# Altium project ((Inventory)).PrjPcb (part 2 of 4)

## Sheet Resistor - 261-312.SchDoc
size A0; SheetNumber: 7; SheetTotal: 14
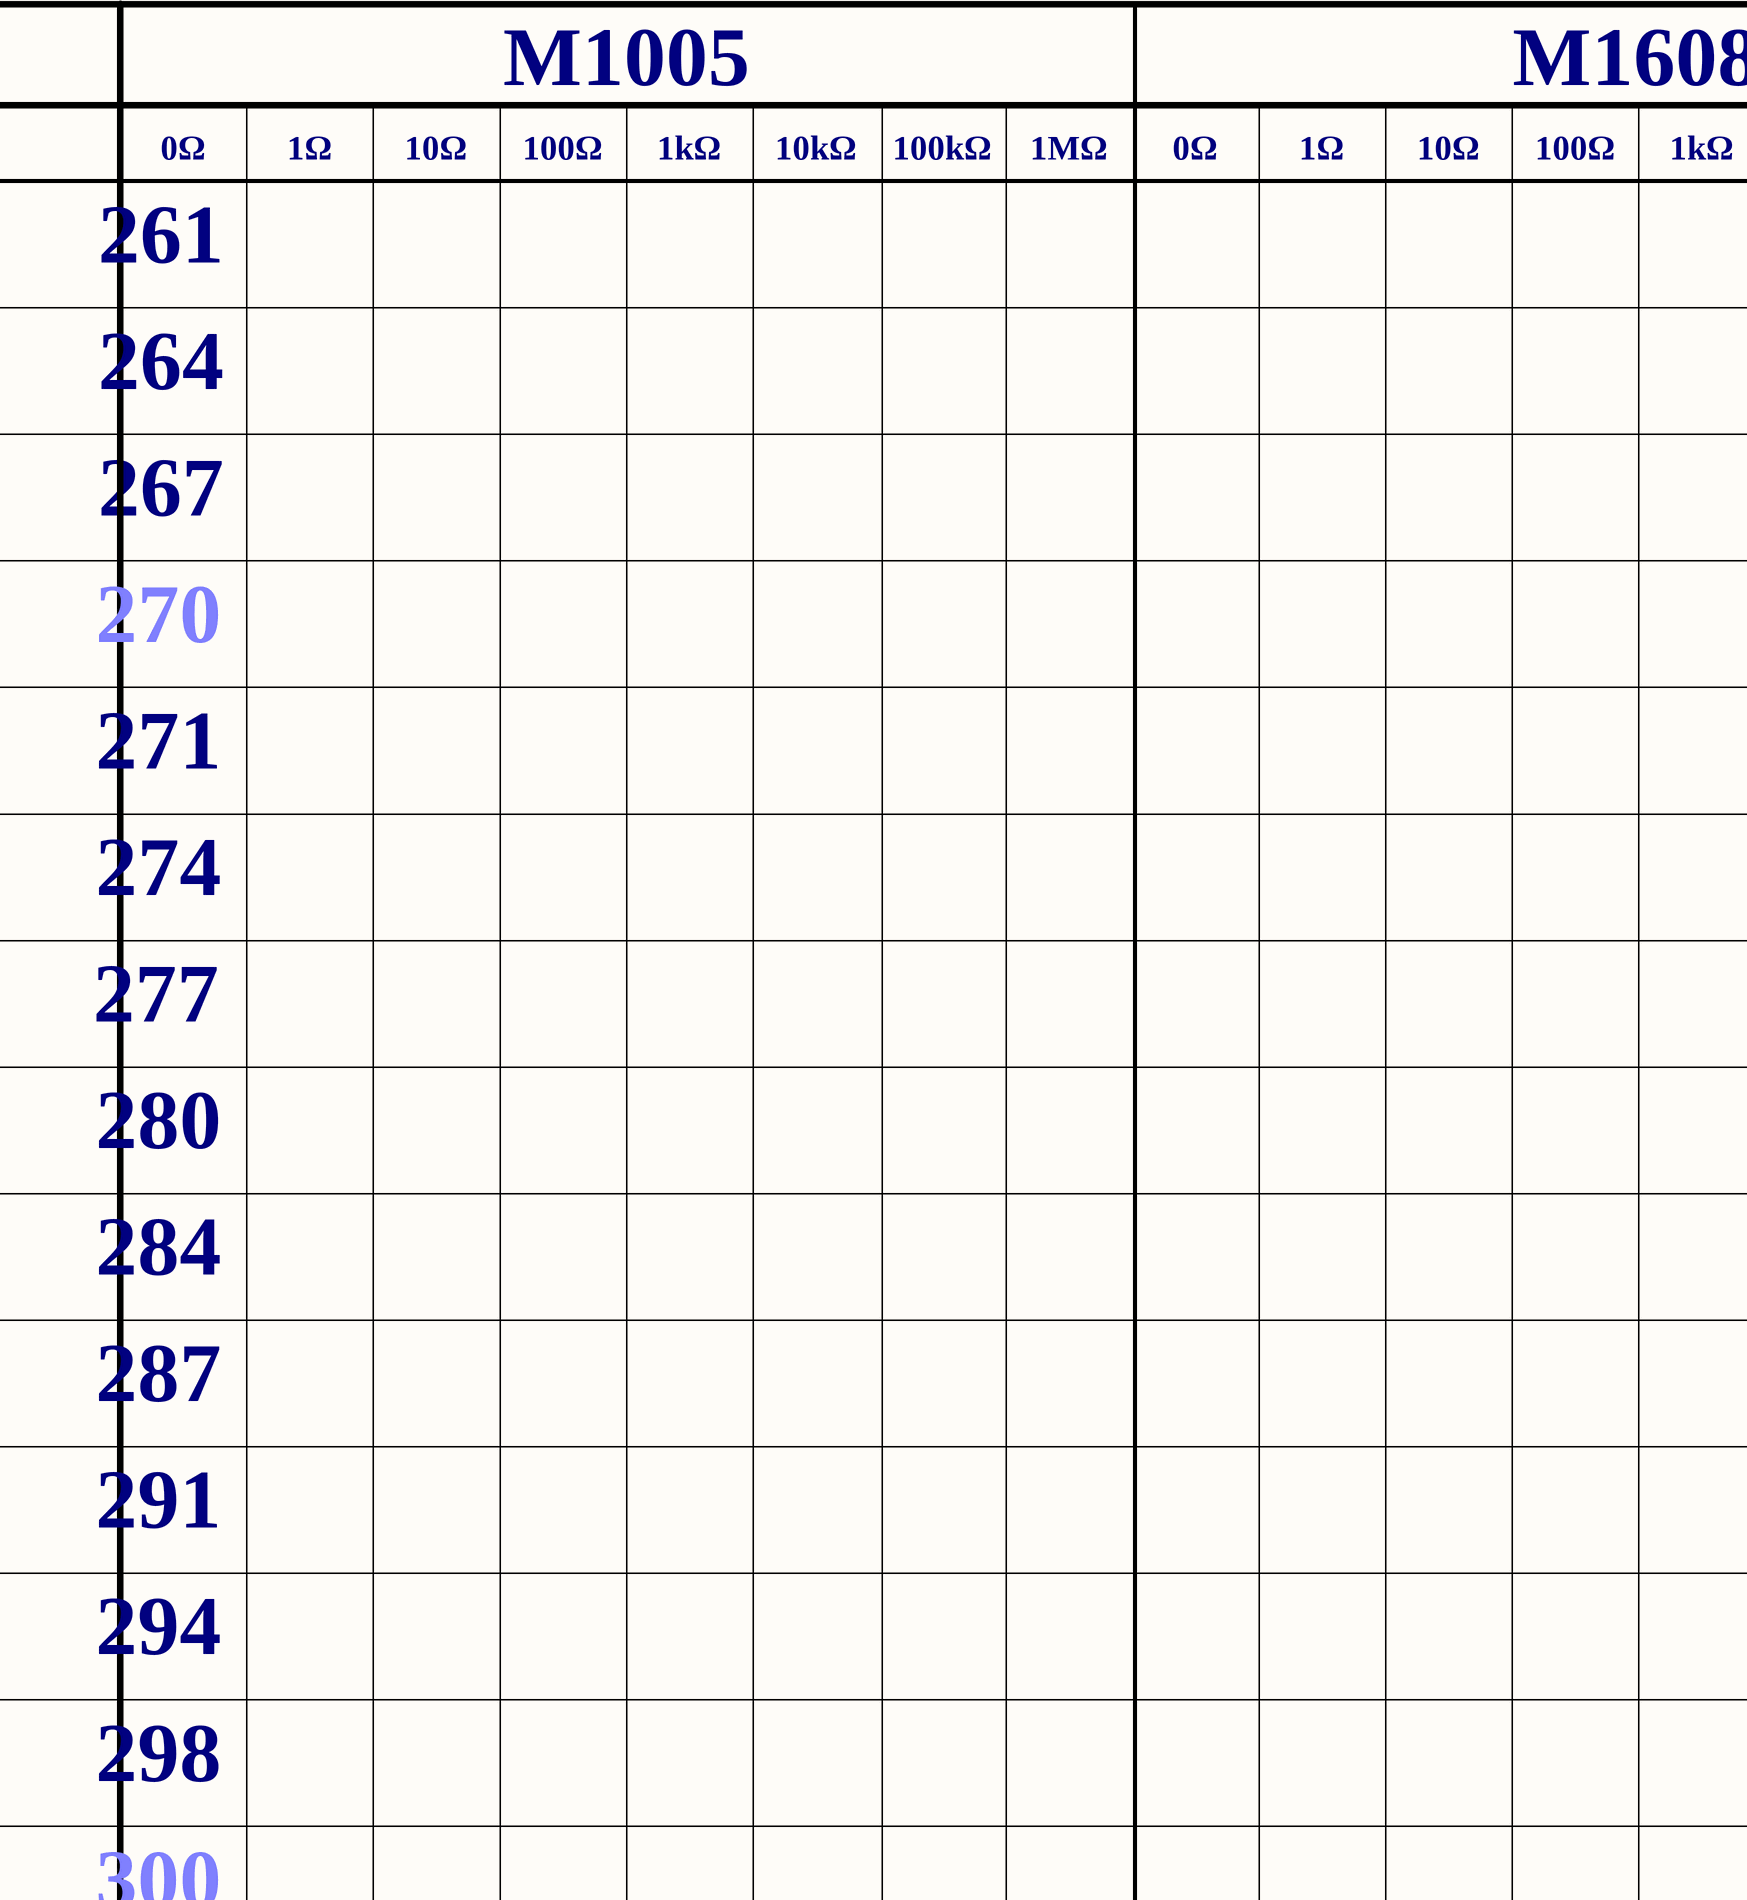
[diagram p21: Resistor - 261-312.SchDoc, top left]
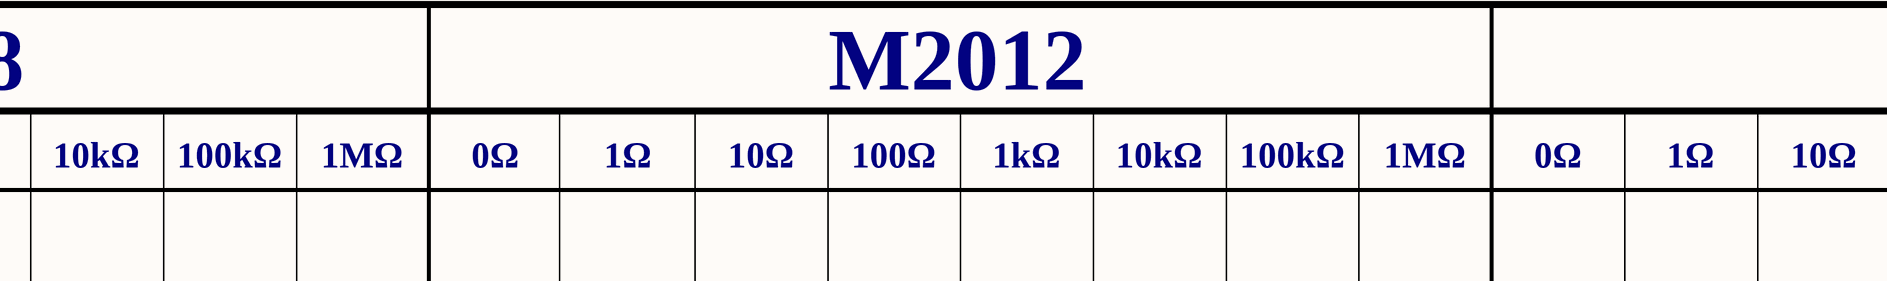
[diagram p22: Resistor - 261-312.SchDoc, top middle]
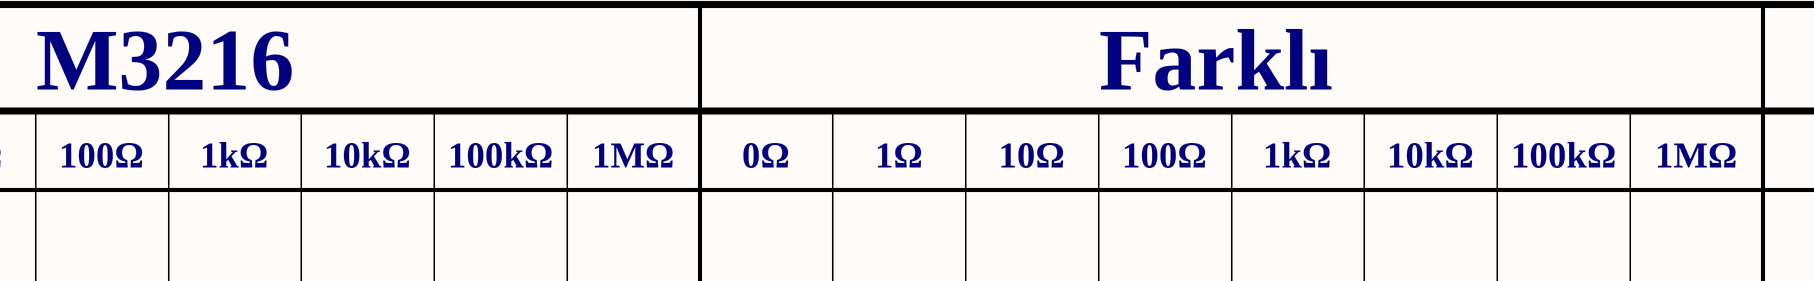
[diagram p23: Resistor - 261-312.SchDoc, top right]
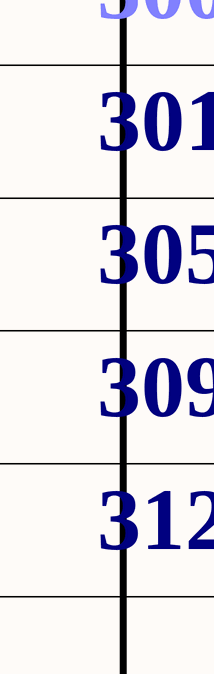
[diagram p24: Resistor - 261-312.SchDoc, bottom left]

### Notes on the sheet
- M1005
- M1608
- M2012
- M3216
- Farklı
- 0Ω
- 1Ω
- 10Ω
- 100Ω
- 1kΩ
- 10kΩ
- 100kΩ
- 1MΩ
- 261
- 264
- 267
- 270
- 271
- 274
- 277
- 280
- 284
- 287
- 291
- 294
- 298
- 300
- 301
- 305
- 309
- 312

## Sheet Resistor - 316-379.SchDoc
size A0; SheetNumber: 8; SheetTotal: 41
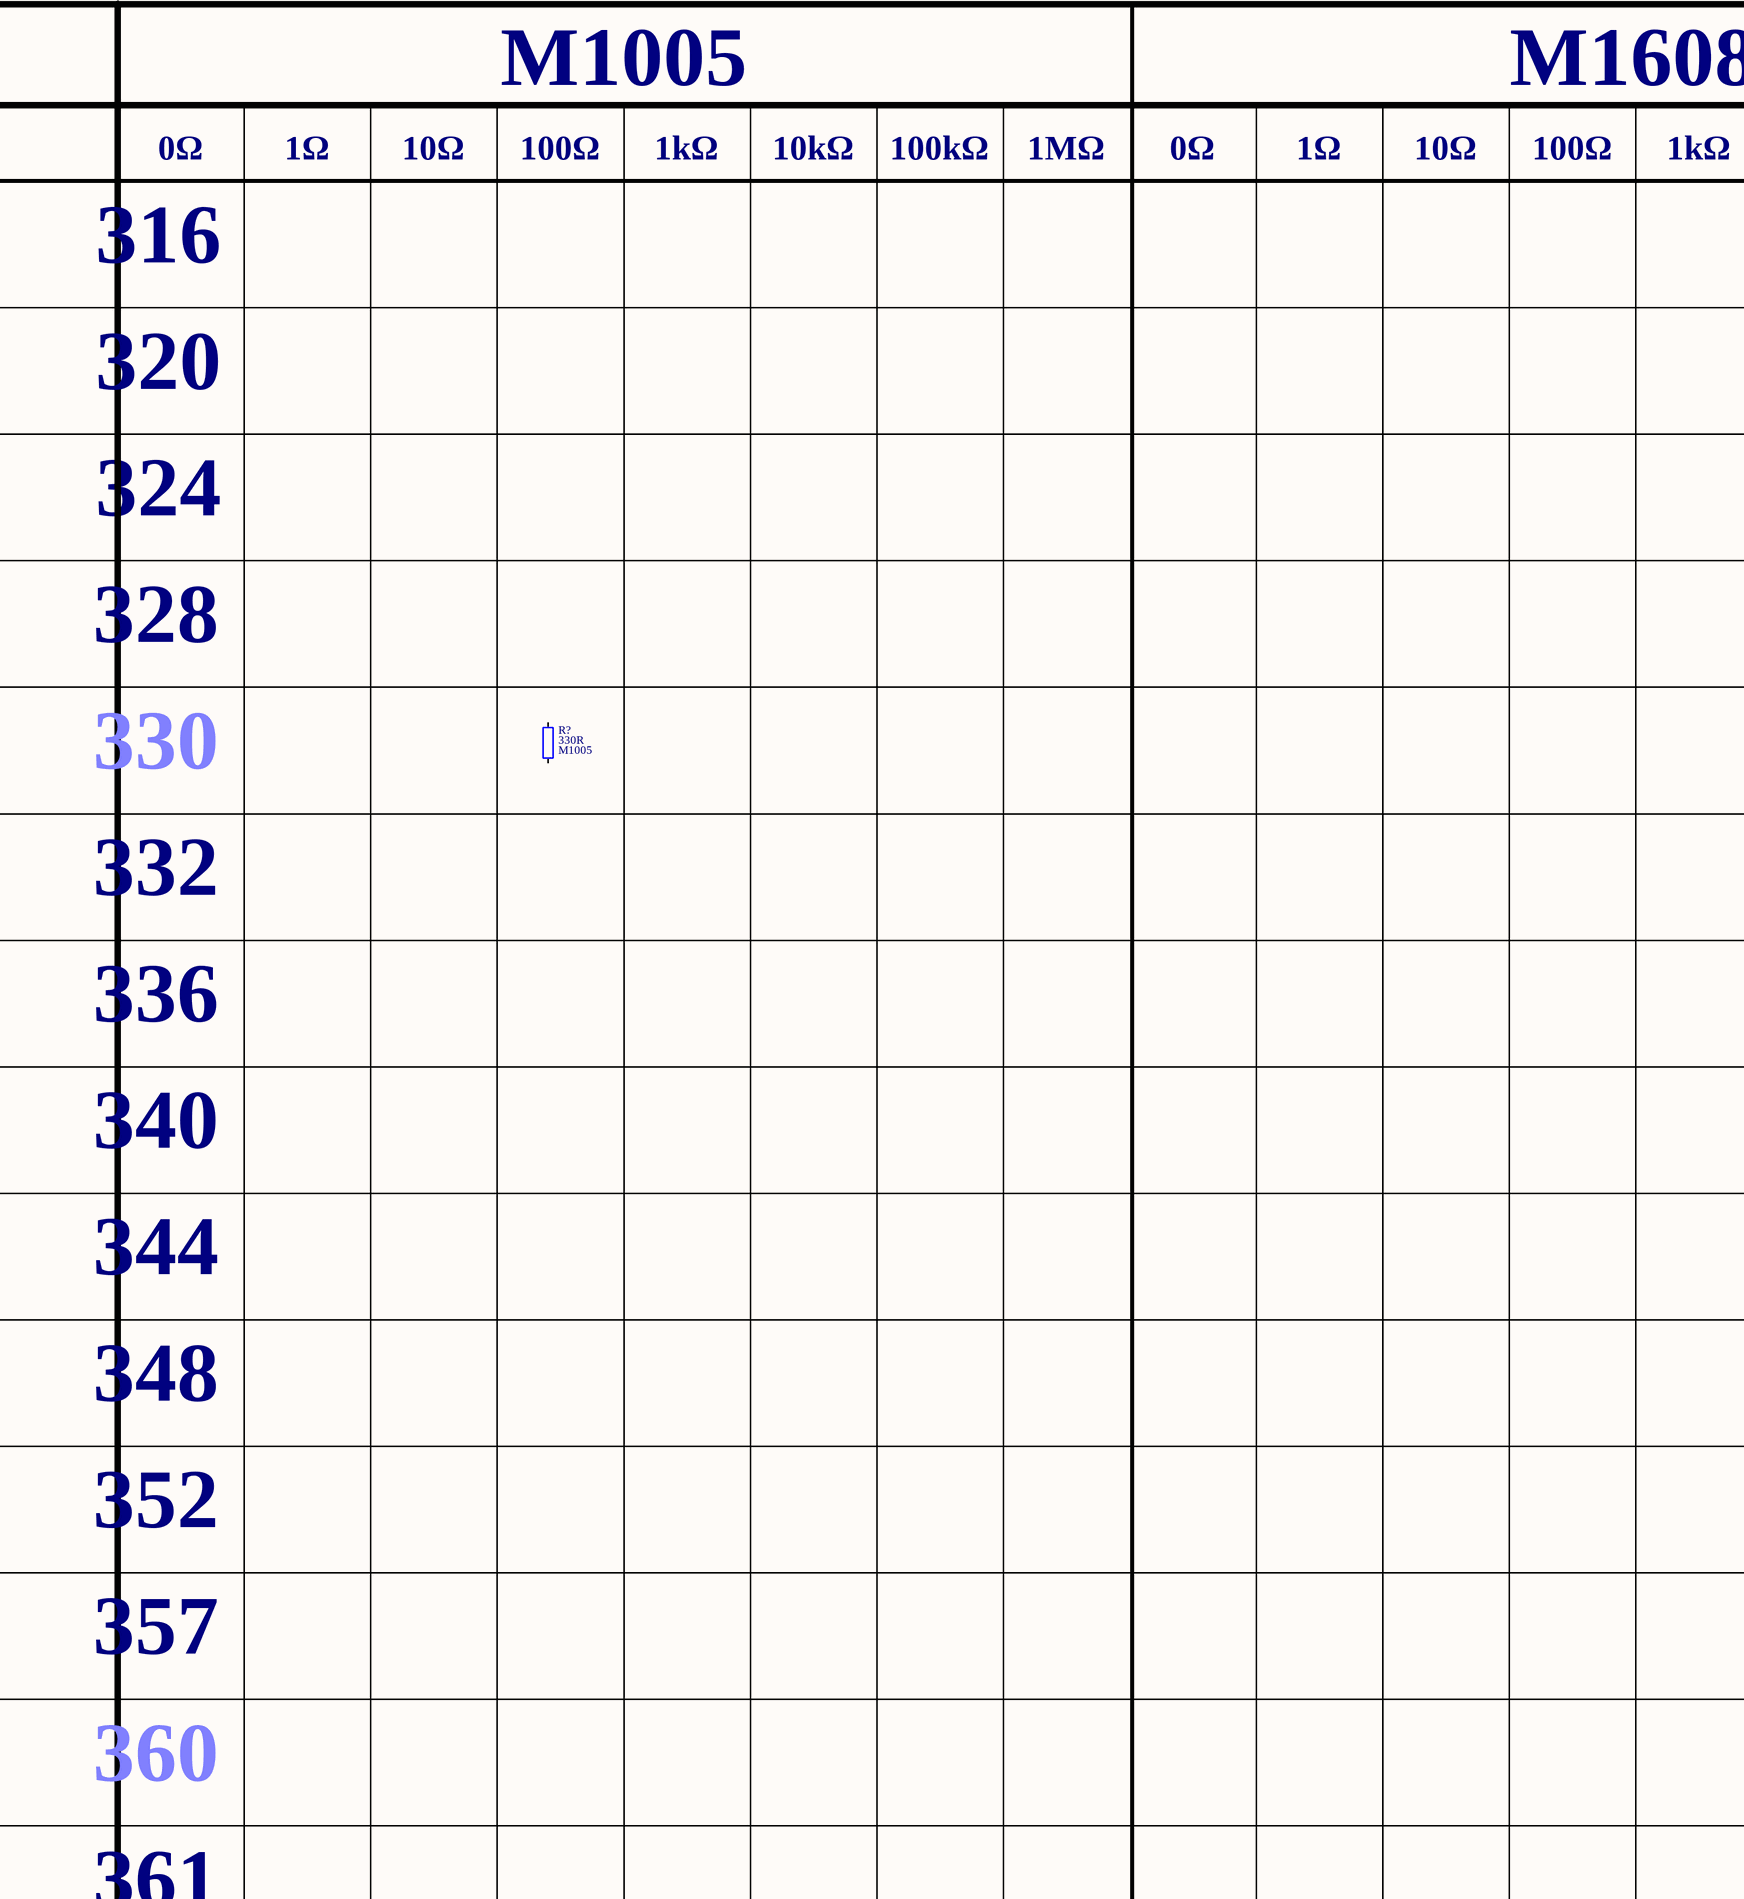
[diagram p25: Resistor - 316-379.SchDoc, top left]
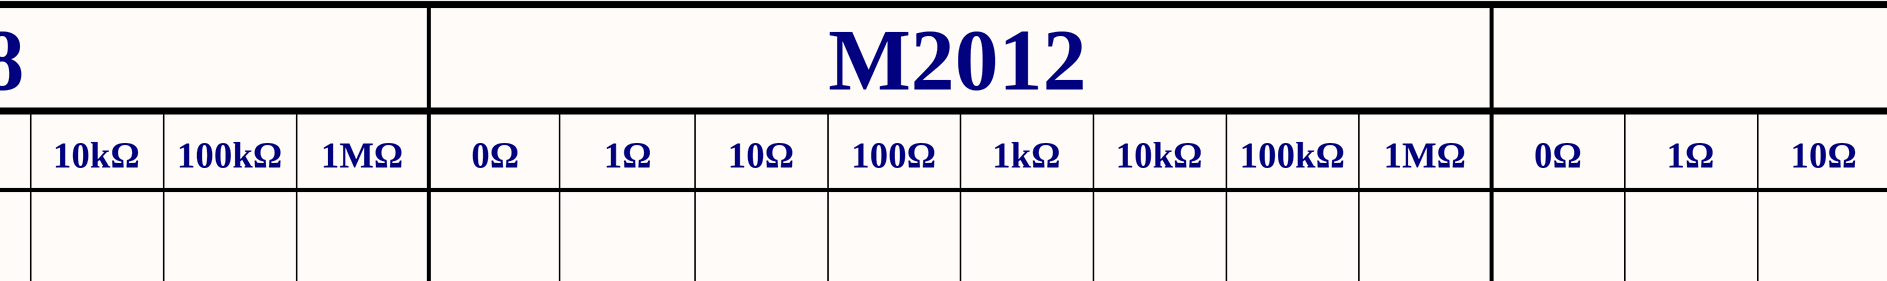
[diagram p26: Resistor - 316-379.SchDoc, top middle]
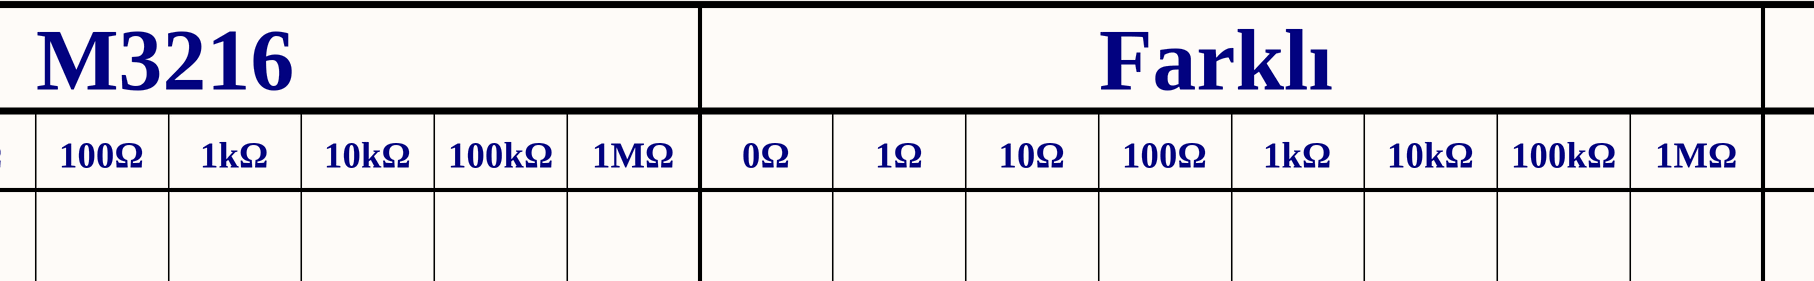
[diagram p27: Resistor - 316-379.SchDoc, top right]
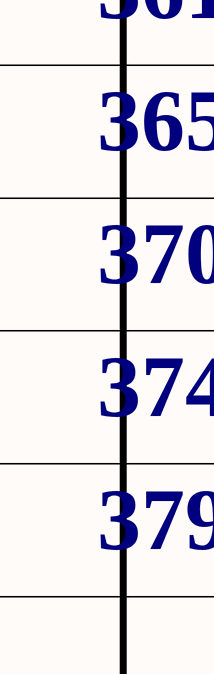
[diagram p28: Resistor - 316-379.SchDoc, bottom left]

### Parts
(Parts that share a designator on the sheet are numbered #1, #2 ... from top to bottom, then left to right.)
R?#12  value 330R  Package: M1005  [Resistor_Smd_M1005_I0402]  (hidden comment: Resistor)

### Nets

Not connected (* = marked no-connect by the designer): R?#12 1 2

### Notes on the sheet
- M1005
- M1608
- M2012
- M3216
- Farklı
- 0Ω
- 1Ω
- 10Ω
- 100Ω
- 1kΩ
- 10kΩ
- 100kΩ
- 1MΩ
- 316
- 320
- 324
- 328
- 330
- 332
- 336
- 340
- 344
- 348
- 352
- 357
- 360
- 361
- 365
- 370
- 374
- 379

### Library data of the parts
R?#12 = Resistor: Res, 330R, 1%, M1005; Manufacturer: Yageo; Manufacturer Part Number: RC0402FR-07330RL; Component Category: Resistor; Component Type: Fixed Value; Tolerance: 1%; Supplier Link: https://www.digikey.com/en/products/detail/yageo/RC0402FR-07330RL/726594; Supplier Currency: $; Price, Max: 0.00129; Price, Min: 0.1; Quantity, Max: 100000; Quantity, Min: 1; Operating Temperature, Max: -55℃; Operating Temperature, Min: +155℃; Supplier Part Number: 311-330LRCT-ND; Supplier: Digikey; ComponentLink1Description: Datasheet; ComponentLink1URL: E:\Altium\Datasheets\Resistor\Yageo - RC_L Series.pdf; ComponentLink2Description: Supplier Link; ComponentLink2URL: https://www.digikey.com/en/products/detail/yageo/RC0402FR-07330RL/726594

## Sheet Resistor - 383-459.SchDoc
size A0; SheetNumber: 9; SheetTotal: 41
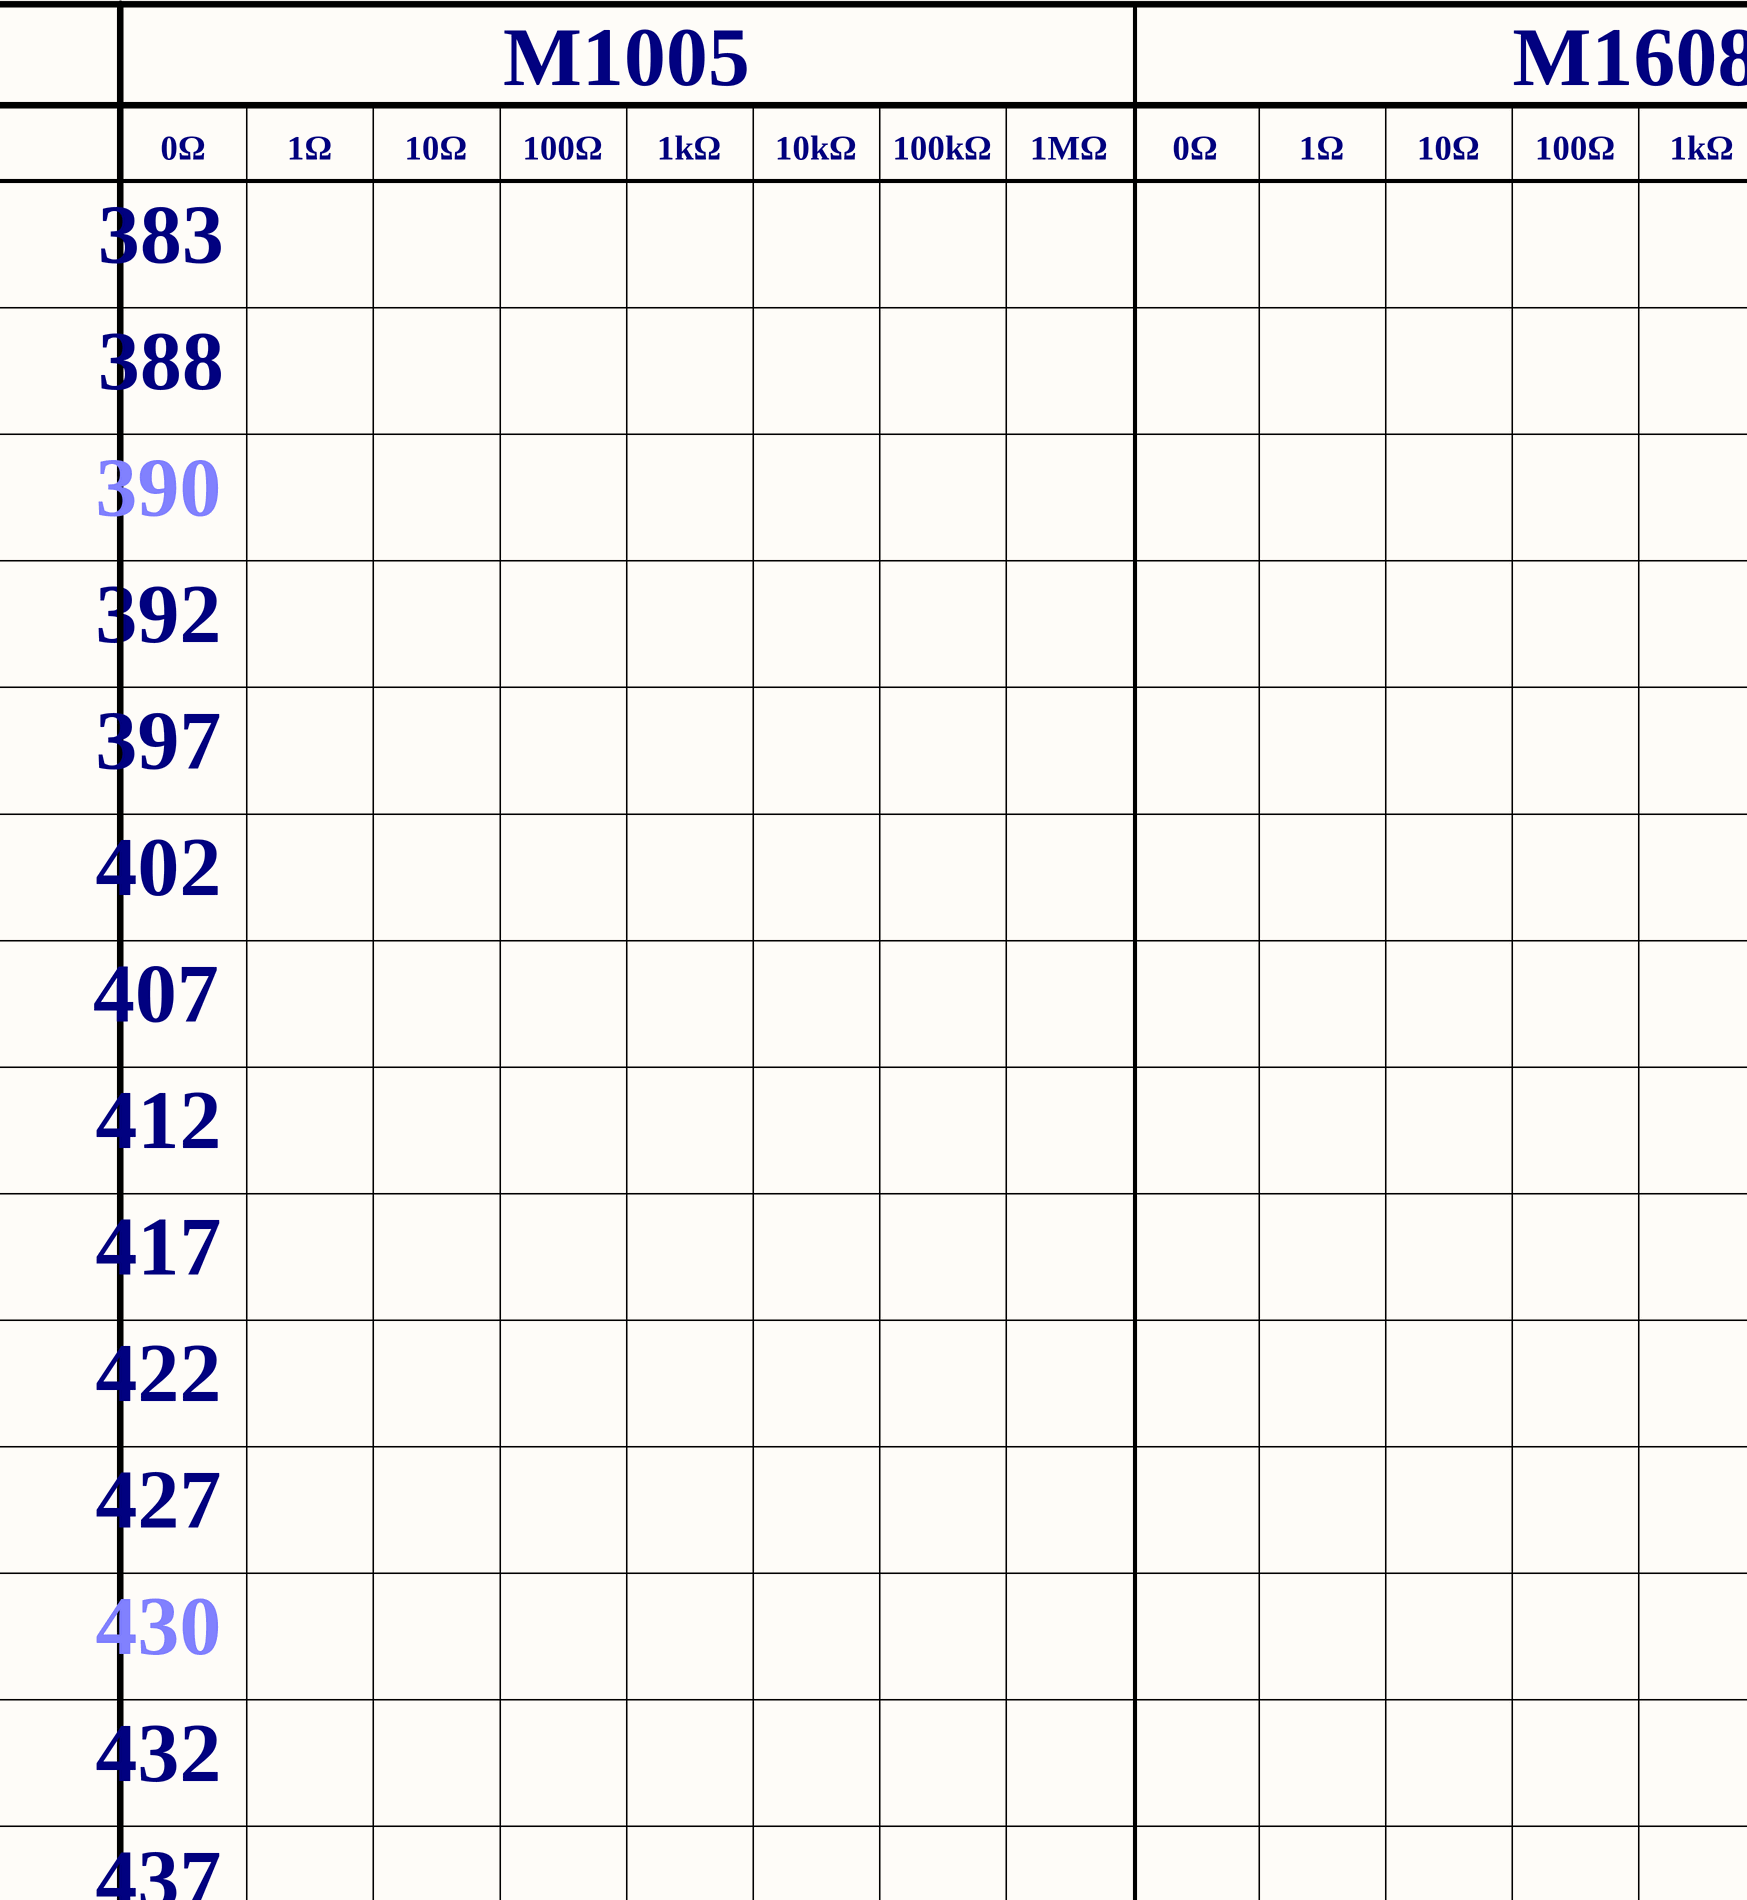
[diagram p29: Resistor - 383-459.SchDoc, top left]
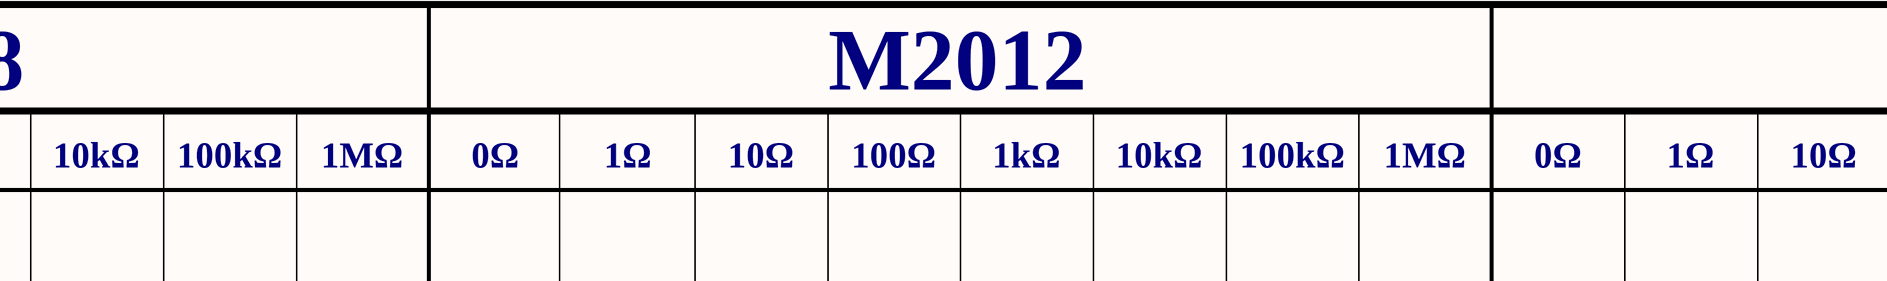
[diagram p30: Resistor - 383-459.SchDoc, top middle]
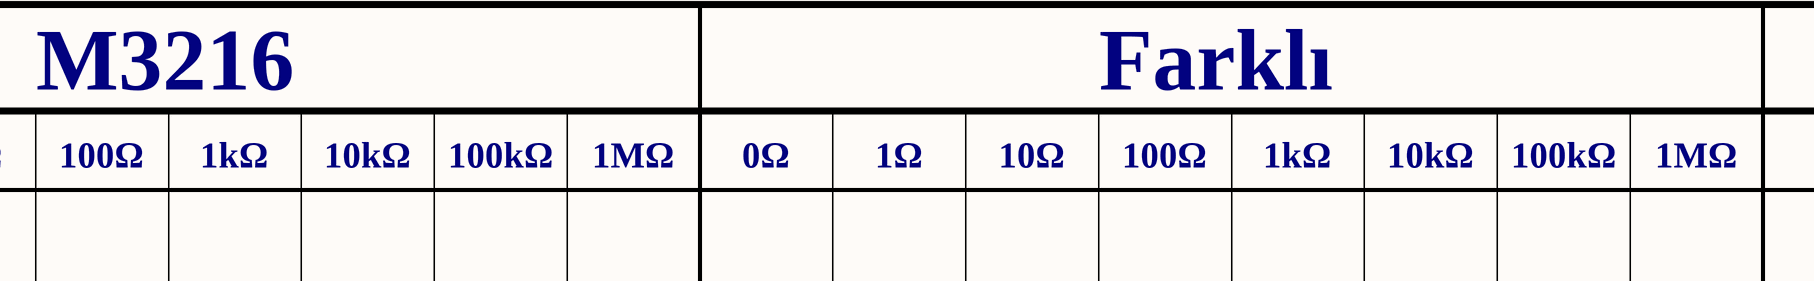
[diagram p31: Resistor - 383-459.SchDoc, top right]
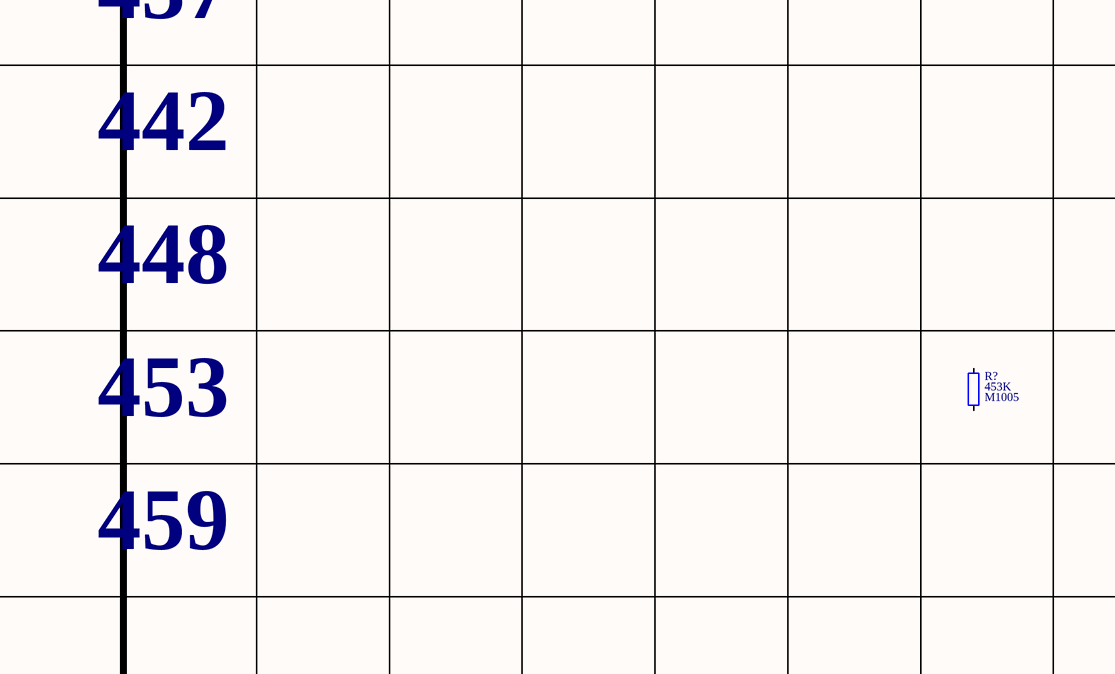
[diagram p32: Resistor - 383-459.SchDoc, bottom left]

### Parts
(Parts that share a designator on the sheet are numbered #1, #2 ... from top to bottom, then left to right.)
R?#13  value 453K  Package: M1005  [Resistor_Smd_M1005_I0402]  (hidden comment: Resistor)

### Nets

Not connected (* = marked no-connect by the designer): R?#13 1 2

### Notes on the sheet
- M1005
- M1608
- M2012
- M3216
- Farklı
- 0Ω
- 1Ω
- 10Ω
- 100Ω
- 1kΩ
- 10kΩ
- 100kΩ
- 1MΩ
- 383
- 388
- 390
- 392
- 397
- 402
- 407
- 412
- 417
- 422
- 427
- 430
- 432
- 437
- 442
- 448
- 453
- 459

### Library data of the parts
R?#13 = Resistor: Res, 453K, 1%, M1005; Manufacturer: Yageo; Manufacturer Part Number: RC0402FR-07453KL; Component Category: Resistor; Component Type: Fixed Value; Tolerance: 1%; Supplier Link: https://www.digikey.com/en/products/detail/yageo/RC0402FR-07453KL/5281024; Supplier Currency: $; Price, Max: 0.00129; Price, Min: 0.1; Quantity, Max: 100000; Quantity, Min: 1; Operating Temperature, Max: -55℃; Operating Temperature, Min: +155℃; Supplier Part Number: YAG3164CT-ND; Supplier: Digikey; ComponentLink1Description: Datasheet; ComponentLink1URL: E:\Altium\Datasheets\Resistor\Yageo - RC_L Series.pdf; ComponentLink2Description: Supplier Link; ComponentLink2URL: https://www.digikey.com/en/products/detail/yageo/RC0402FR-07453KL/5281024

## Sheet Resistor - 464-556.SchDoc
size A0; SheetNumber: 10; SheetTotal: 41
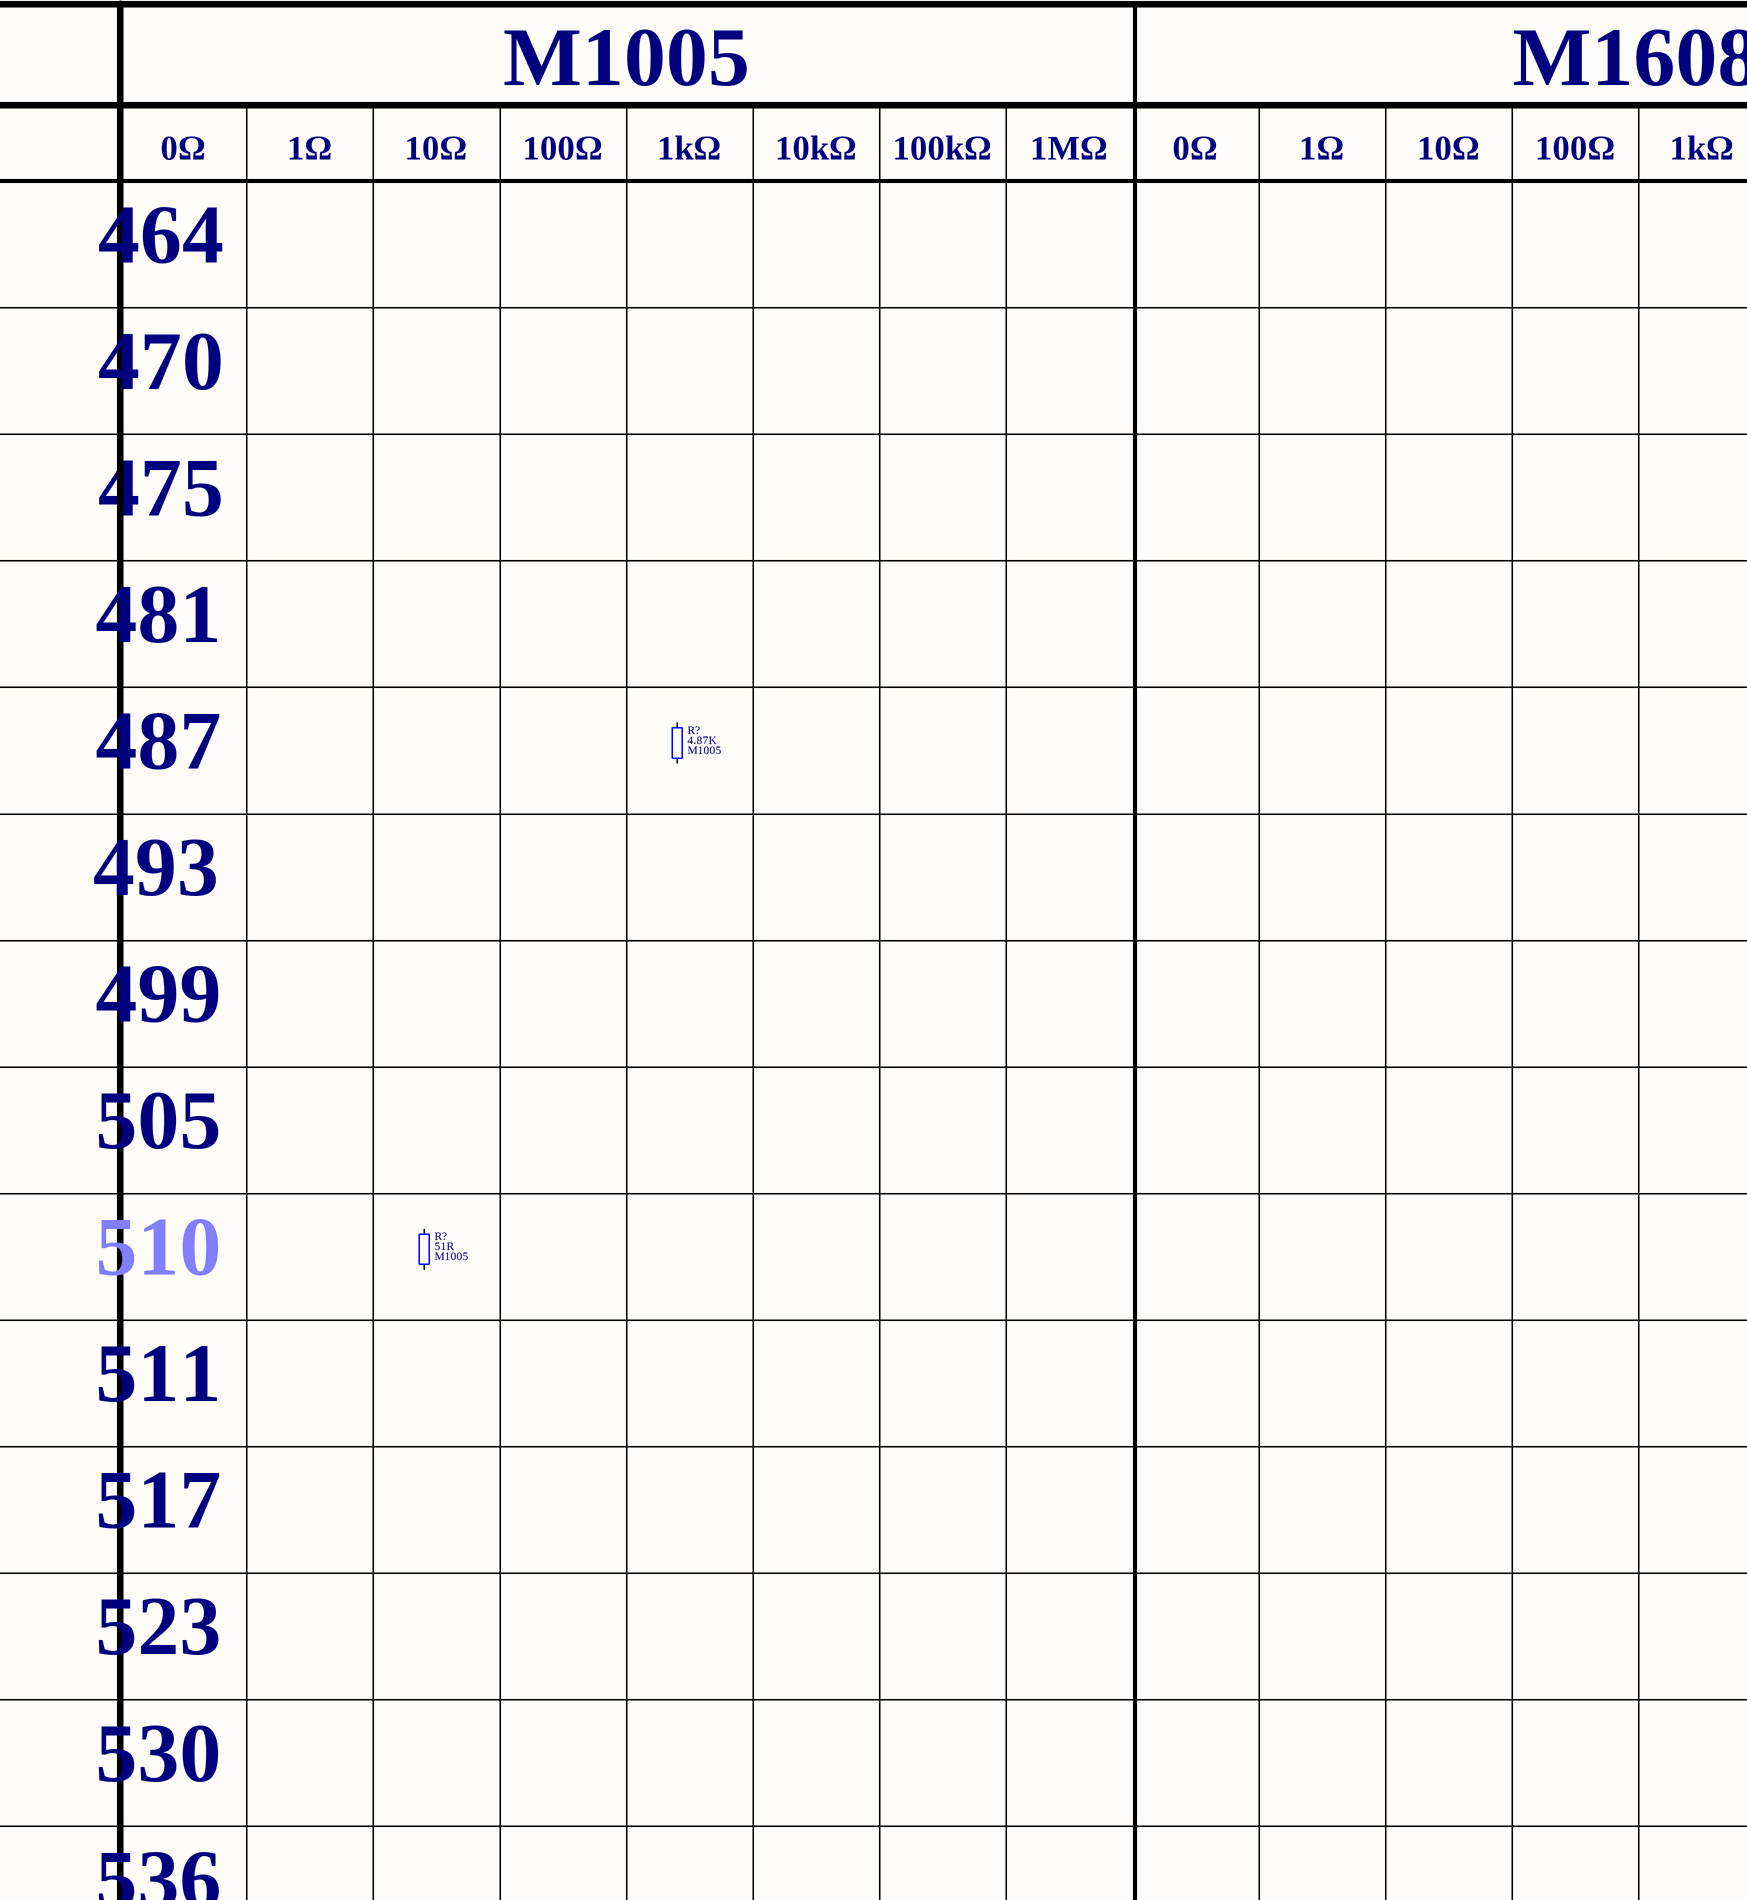
[diagram p33: Resistor - 464-556.SchDoc, top left]
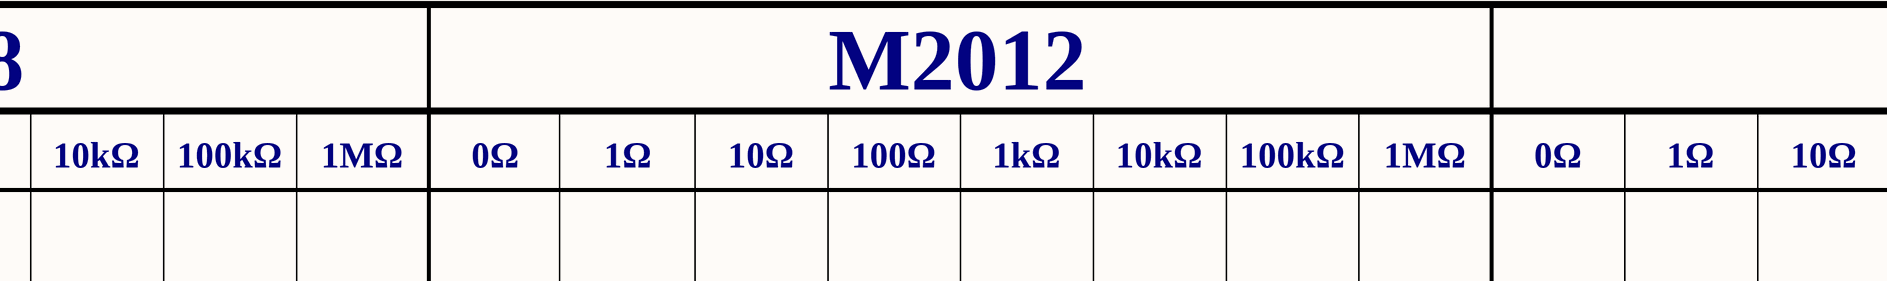
[diagram p34: Resistor - 464-556.SchDoc, top middle]
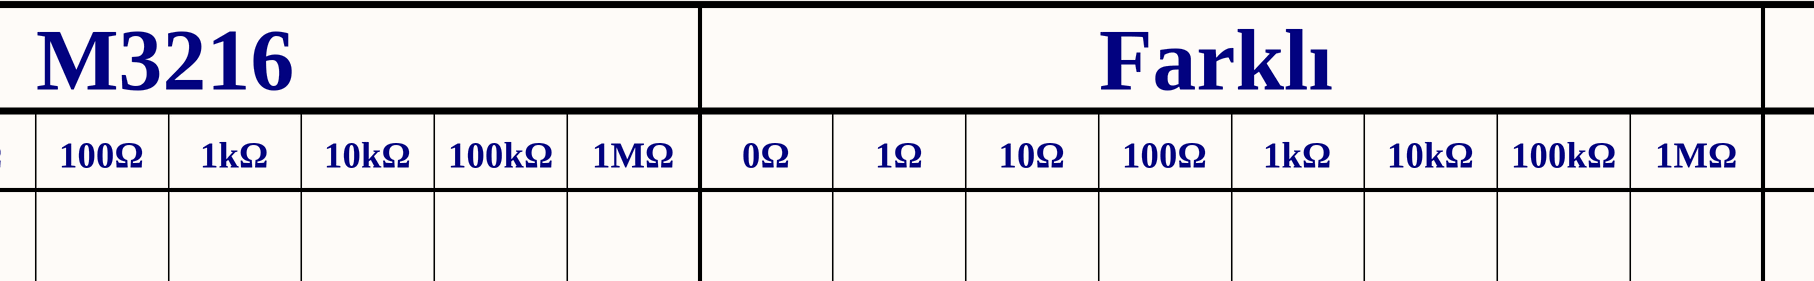
[diagram p35: Resistor - 464-556.SchDoc, top right]
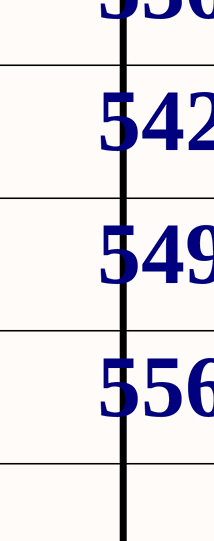
[diagram p36: Resistor - 464-556.SchDoc, bottom left]

### Parts
(Parts that share a designator on the sheet are numbered #1, #2 ... from top to bottom, then left to right.)
R?#14  value 4.87K  Package: M1005  [Resistor_Smd_M1005_I0402]  (hidden comment: Resistor)
R?#15  value 51R  Package: M1005  [Resistor_Smd_M1005_I0402]  (hidden comment: Resistor)

### Nets

Not connected (* = marked no-connect by the designer): R?#14 1 2; R?#15 1 2

### Notes on the sheet
- M1005
- M1608
- M2012
- M3216
- Farklı
- 0Ω
- 1Ω
- 10Ω
- 100Ω
- 1kΩ
- 10kΩ
- 100kΩ
- 1MΩ
- 464
- 470
- 475
- 481
- 487
- 493
- 499
- 505
- 510
- 511
- 517
- 523
- 530
- 536
- 542
- 549
- 556

### Library data of the parts
R?#14 = Resistor: Res, 4.87K, 1%, M1005; Manufacturer: Yageo; Manufacturer Part Number: RC0402FR-074K87L; Component Category: Resistor; Component Type: Fixed Value; Tolerance: 1%; Supplier Link: https://www.digikey.com/en/products/detail/yageo/RC0402FR-074K87L/5281035; Supplier Currency: $; Price, Max: 0.00129; Price, Min: 0.1; Quantity, Max: 100000; Quantity, Min: 1; Operating Temperature, Max: -55℃; Operating Temperature, Min: +155℃; Supplier Part Number: YAG3175CT-ND; Supplier: Digikey; ComponentLink1Description: Datasheet; ComponentLink1URL: E:\Altium\Datasheets\Resistor\Yageo - RC_L Series.pdf; ComponentLink2Description: Supplier Link; ComponentLink2URL: https://www.digikey.com/en/products/detail/yageo/RC0402FR-074K87L/5281035
R?#15 = Resistor: Res, 51R, 1%, M1005; Manufacturer: Yageo; Manufacturer Part Number: RC0402FR-0751RL; Component Category: Resistor; Component Type: Fixed Value; Tolerance: 1%; Supplier Link: https://www.digikey.com/en/products/detail/yageo/RC0402FR-0751RL/726629; Supplier Currency: $; Price, Max: 0.00129; Price, Min: 0.1; Quantity, Max: 100000; Quantity, Min: 1; Operating Temperature, Max: -55℃; Operating Temperature, Min: +155℃; Supplier Part Number: 311-51.0LRCT-ND; Supplier: Digikey; ComponentLink1Description: Datasheet; ComponentLink1URL: E:\Altium\Datasheets\Resistor\Yageo - RC_L Series.pdf; ComponentLink2Description: Supplier Link; ComponentLink2URL: https://www.digikey.com/en/products/detail/yageo/RC0402FR-0751RL/726629

## Sheet Resistor - 562-673.SchDoc
size A0; SheetNumber: 11; SheetTotal: 41
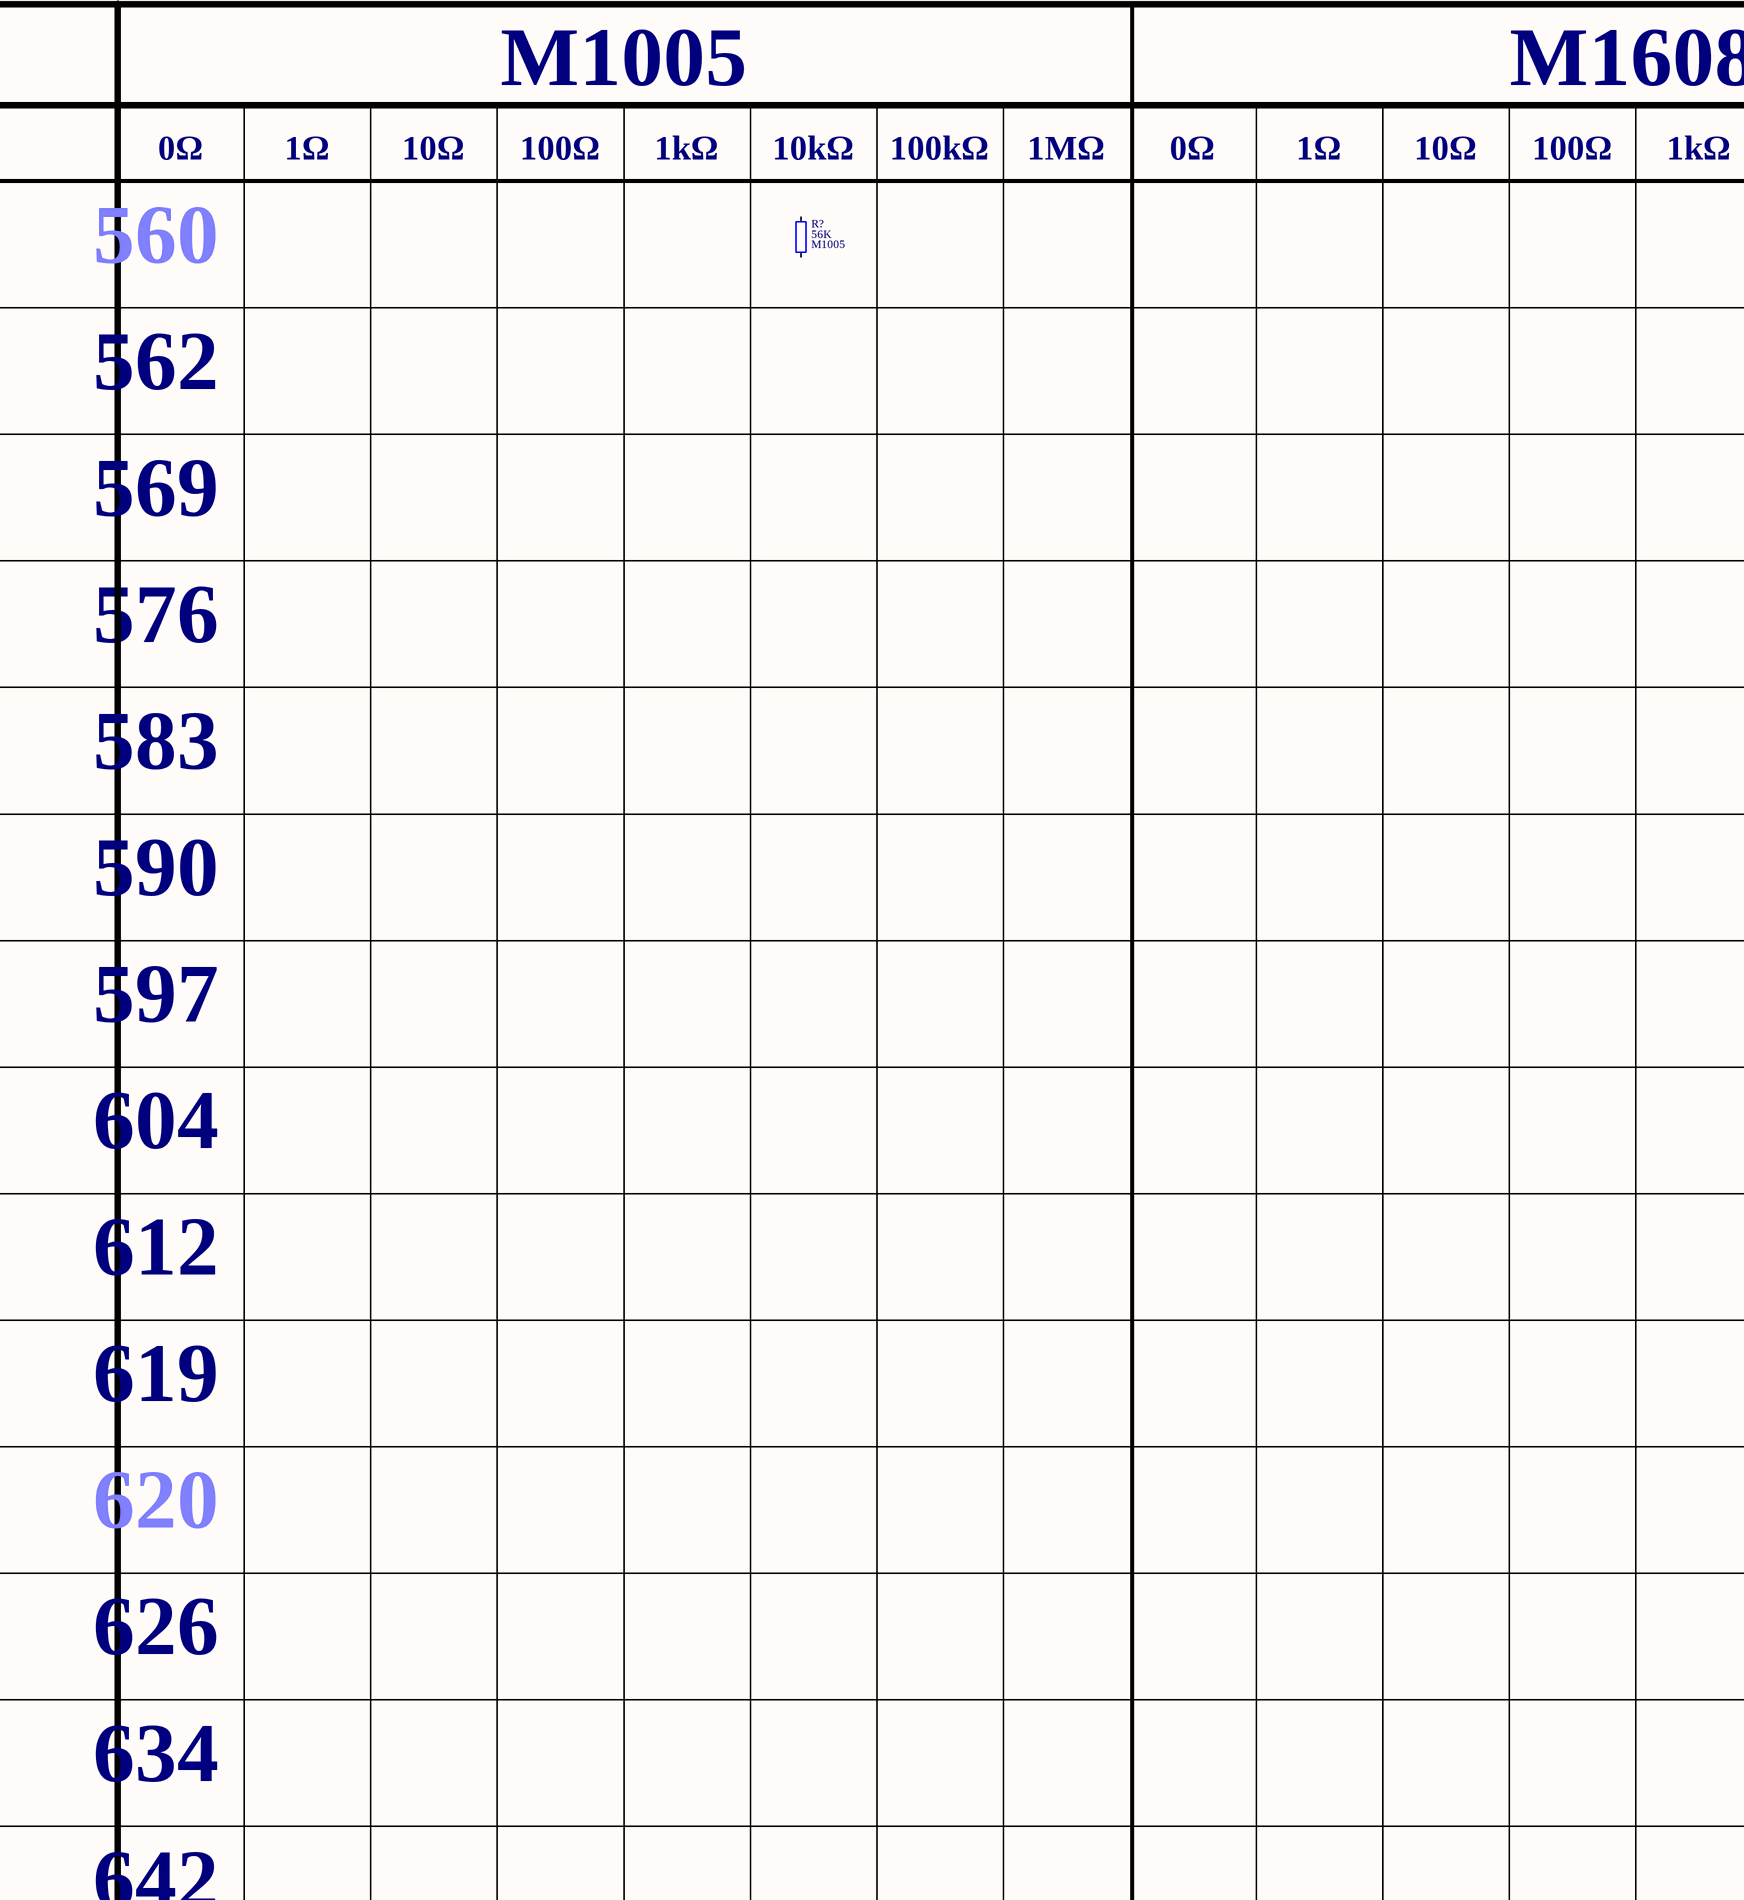
[diagram p37: Resistor - 562-673.SchDoc, top left]
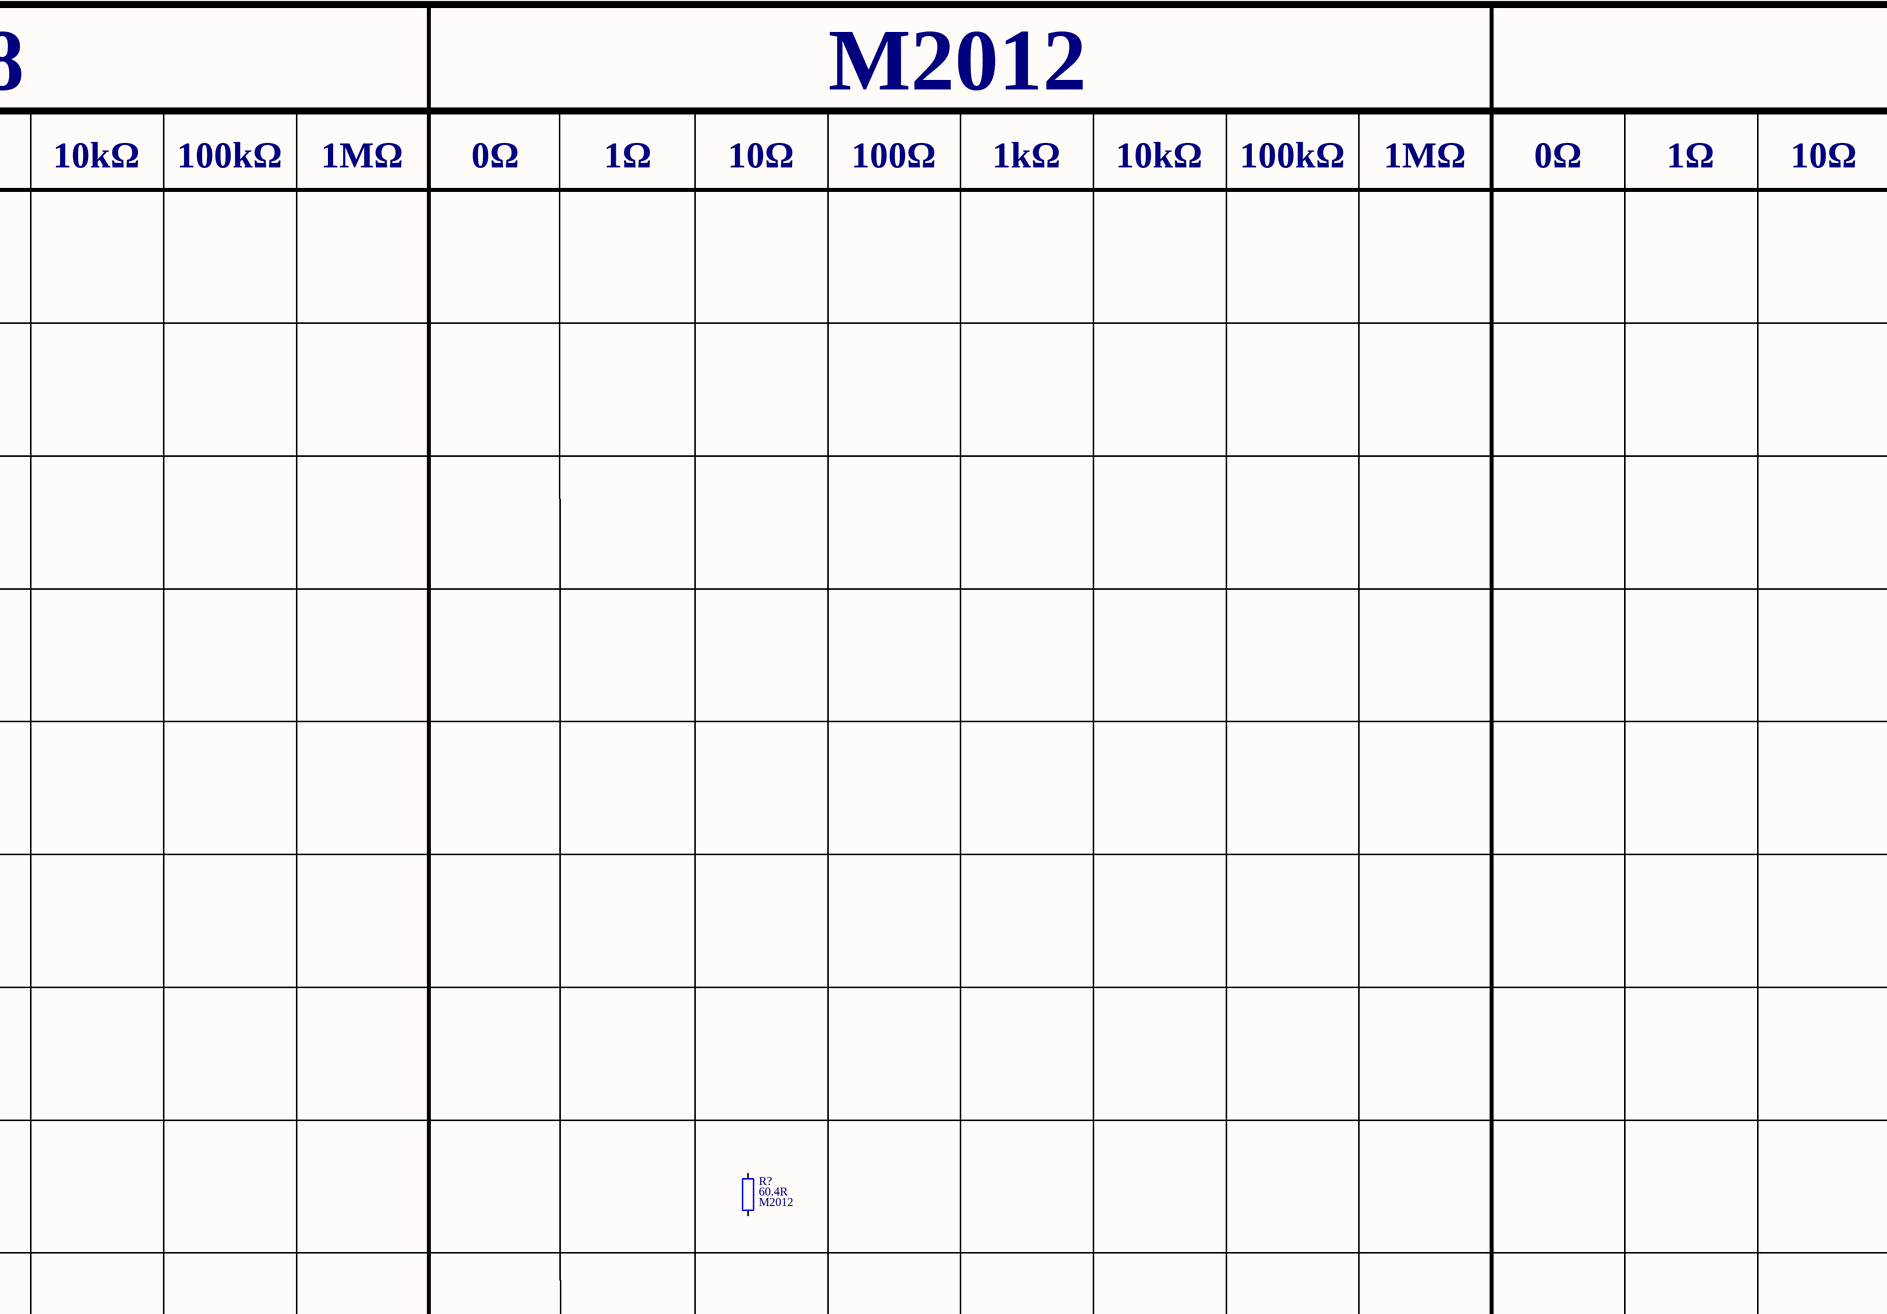
[diagram p38: Resistor - 562-673.SchDoc, top middle]
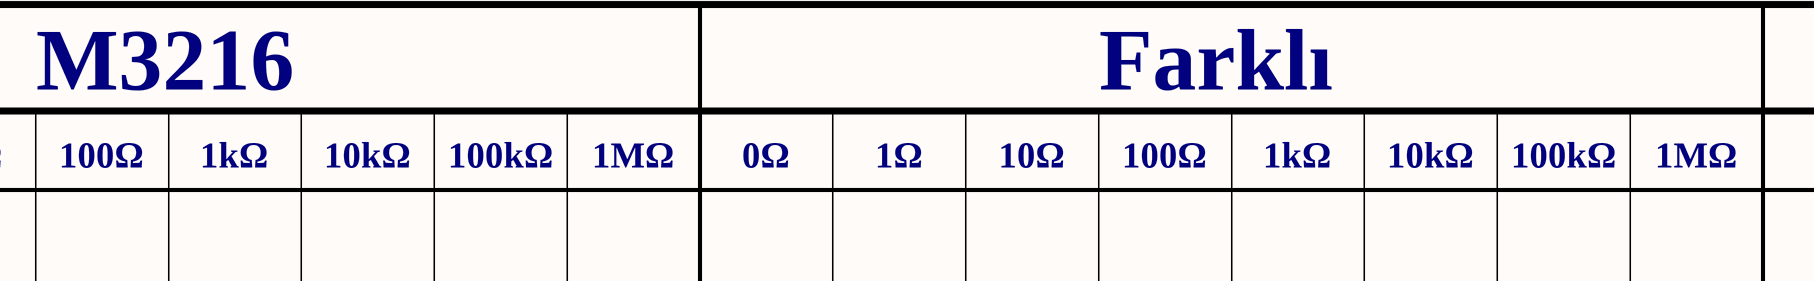
[diagram p39: Resistor - 562-673.SchDoc, top right]
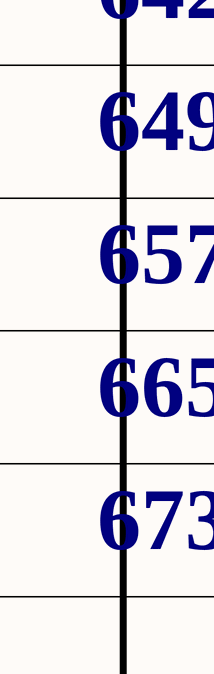
[diagram p40: Resistor - 562-673.SchDoc, bottom left]

### Parts
(Parts that share a designator on the sheet are numbered #1, #2 ... from top to bottom, then left to right.)
R?#16  value 56K  Package: M1005  [Resistor_Smd_M1005_I0402]  (hidden comment: Resistor)
R?#17  value 60.4R  Package: M2012  [Resistor_Smd_M2012_I0805]  (hidden comment: Resistor)

### Nets

Not connected (* = marked no-connect by the designer): R?#16 1 2; R?#17 1 2

### Notes on the sheet
- M1005
- M1608
- M2012
- M3216
- Farklı
- 0Ω
- 1Ω
- 10Ω
- 100Ω
- 1kΩ
- 10kΩ
- 100kΩ
- 1MΩ
- 560
- 562
- 569
- 576
- 583
- 590
- 597
- 604
- 612
- 619
- 620
- 626
- 634
- 642
- 649
- 657
- 665
- 673

### Library data of the parts
R?#16 = Resistor: Res, 56K, 1%, M1005; Manufacturer: Yageo; Manufacturer Part Number: RC0402FR-0756KL; Component Category: Resistor; Component Type: Fixed Value; Tolerance: 1%; Supplier Link: https://www.digikey.com/en/products/detail/yageo/RC0402FR-0756KL/726635; Supplier Currency: $; Price, Max: 0.00129; Price, Min: 0.1; Quantity, Max: 100000; Quantity, Min: 1; Operating Temperature, Max: -55℃; Operating Temperature, Min: +155℃; Supplier Part Number: 311-56.0KLRCT-ND; Supplier: Digikey; ComponentLink1Description: Datasheet; ComponentLink1URL: E:\Altium\Datasheets\Resistor\Yageo - RC_L Series.pdf; ComponentLink2Description: Supplier Link; ComponentLink2URL: https://www.digikey.com/en/products/detail/yageo/RC0402FR-0756KL/726635
R?#17 = Resistor: Res, 60.4R, 1%, M1005; Manufacturer: Yageo; Manufacturer Part Number: RC0805FR-0760R4L; Component Category: Resistor; Component Type: Fixed Value; Tolerance: 1%; Supplier Link: https://www.digikey.com/en/products/detail/yageo/RC0805FR-0760R4L/728073; Supplier Currency: $; Price, Max: 0.00328; Price, Min: 0.1; Quantity, Max: 125000; Quantity, Min: 1; Operating Temperature, Max: -55℃; Operating Temperature, Min: +155℃; Supplier Part Number: 311-60.4CRCT-ND; Supplier: Digikey; ComponentLink1Description: Datasheet; ComponentLink1URL: E:\Altium\Datasheets\Resistor\Yageo - RC_L Series.pdf; ComponentLink2Description: Supplier Link; ComponentLink2URL: https://www.digikey.com/en/products/detail/yageo/RC0805FR-0760R4L/728073